# Altium schematic sheet HC-SR04_v3_SCH.SchDoc
size A3; SheetNumber: 1; SheetTotal: 1
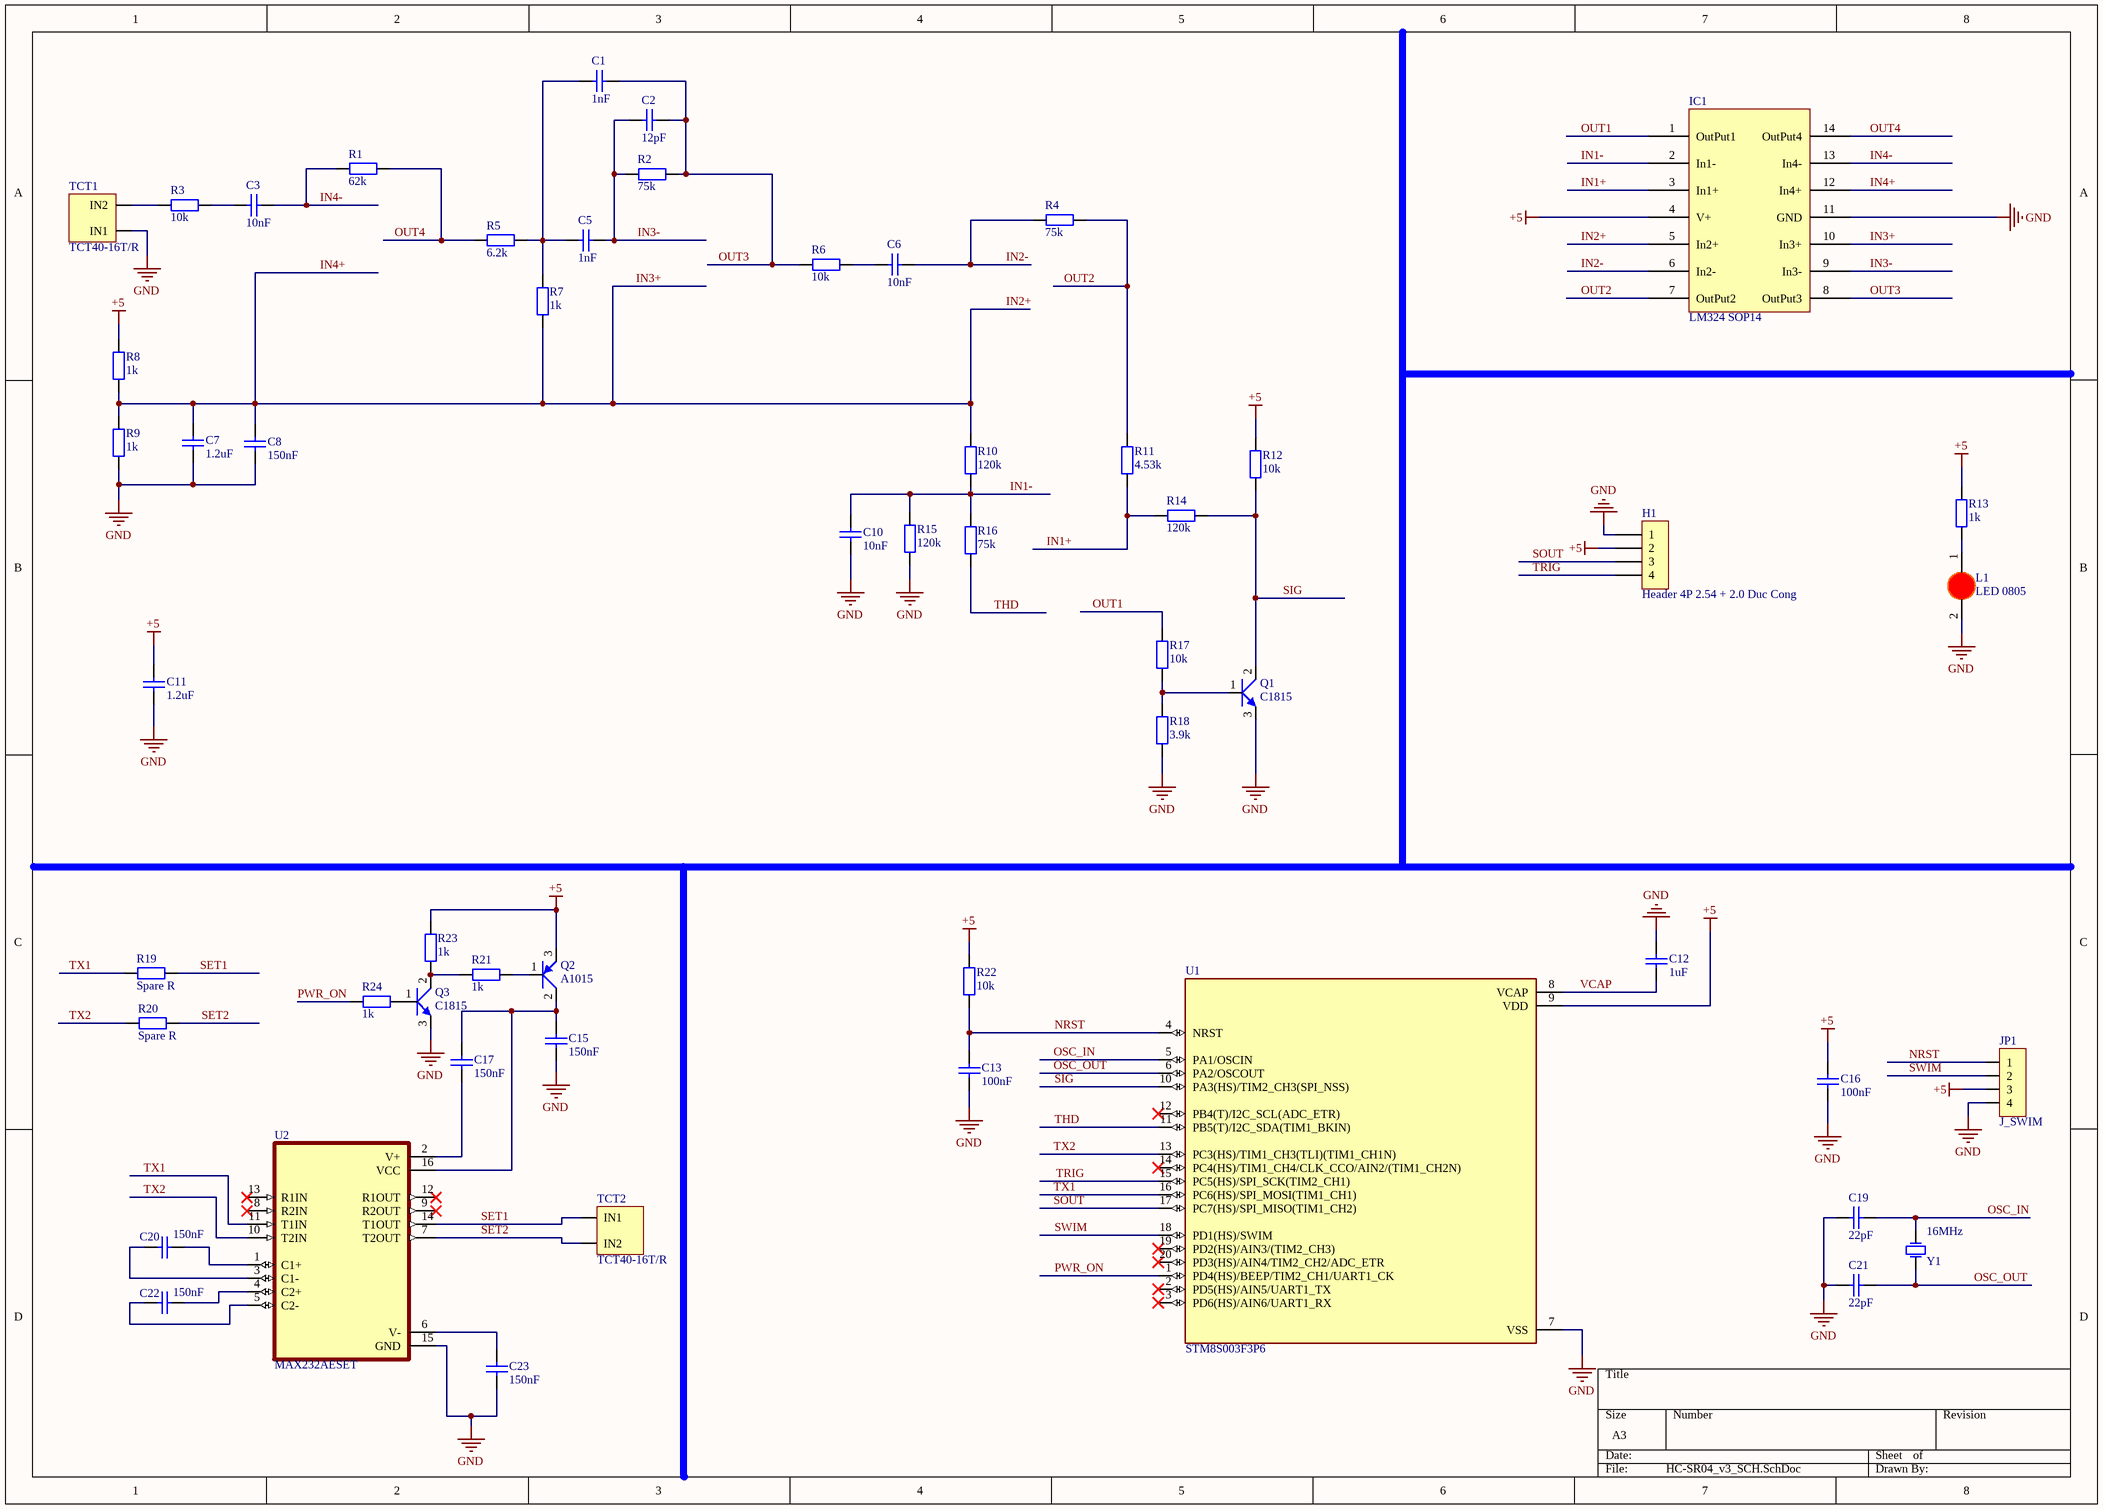
[diagram p0: HC-SR04_v3_SCH.SchDoc]

## Parts
C1  1nF  [CAP_SMD_0603]
C2  12pF  [CAP_SMD_0603]
C3  10nF  [CAP_SMD_0603]
C5  1nF  [CAP_SMD_0603]
C6  10nF  [CAP_SMD_0603]
C7  1.2uF  [CAP_SMD_0603]
C8  150nF  [CAP_SMD_0603]
C10  10nF  [CAP_SMD_0603]
C11  1.2uF  [CAP_SMD_0603]
C12  1uF  [CAP_SMD_0603]
C13  100nF  [CAP_SMD_0603]
C15  150nF  [CAP_SMD_0603]
C16  100nF  [CAP_SMD_0603]
C17  150nF  [CAP_SMD_0603]
C19  22pF  [CAP_SMD_0603]
C20  150nF  [CAP_SMD_0603]
C21  22pF  [CAP_SMD_0603]
C22  150nF  [CAP_SMD_0603]
C23  150nF  [CAP_SMD_0603]
H1  Header 4P 2.54 + 2.0 Duc Cong  [Header 4P DC 2.54 + 2.0]
IC1  LM324 SOP14  [SOIC14]
JP1  J_SWIM  [JP 1x4 DT]
L1  LED 0805  [LED-0805-Red]
Q1  C1815  [SOT23]
Q2  A1015  [SOT23]
Q3  C1815  [SOT23]
R1  62k  [RES_SMD_0603]
R2  75k  [RES_SMD_0603]
R3  10k  [RES_SMD_0603]
R4  75k  [RES_SMD_0603]
R5  6.2k  [RES_SMD_0603]
R6  10k  [RES_SMD_0603]
R7  1k  [RES_SMD_0603]
R8  1k  [RES_SMD_0603]
R9  1k  [RES_SMD_0603]
R10  120k  [RES_SMD_0603]
R11  4.53k  [RES_SMD_0603]
R12  10k  [RES_SMD_0603]
R13  1k  [RES_SMD_0603]
R14  120k  [RES_SMD_0603]
R15  120k  [RES_SMD_0603]
R16  75k  [RES_SMD_0603]
R17  10k  [RES_SMD_0603]
R18  3.9k  [RES_SMD_0603]
R19  Spare R  [RES_SMD_0603]
R20  Spare R  [RES_SMD_0603]
R21  1k  [RES_SMD_0603]
R22  10k  [RES_SMD_0603]
R23  1k  [RES_SMD_0603]
R24  1k  [RES_SMD_0603]
TCT1  TCT40-16T/R  [TCT40]
TCT2  TCT40-16T/R  [TCT40]
U1  STM8S003F3P6  [SOP65P640X120-20N]
U2  MAX232AESET  [SOIC16]
Y1  16MHz  [THACH ANH DAN 3215]

## Nets
+5: C11.1 C16.1 H1.2 IC1.4(V+) JP1.3 Q2.3(E) R8.2 R12.2 R13.2 R22.1 R23.1 U1.9(VDD)
GND: C7.2 C8.2 C10.2 C11.2 C12.1 C13.2 C15.2 C16.2 C19.1 C21.1 C23.2 H1.1 IC1.11(GND) JP1.4 L1.2(K) Q1.3(E) Q3.3(E) R9.1 R15.1 R18.1 TCT1.1(IN1) U1.7(VSS) U2.15(GND)
IN1+: IC1.3(In1+) R11.2 R14.1
IN1-: C10.1 IC1.2(In1-) R10.2 R15.2 R16.2
IN2+: C7.1 C8.1 IC1.5(In2+) IC1.10(In3+) IC1.12(In4+) R7.2 R8.1 R9.2 R10.1  [also labelled IN3+, IN4+]
IN2-: C6.1 IC1.6(In2-) R4.2
IN3-: C2.2 C5.1 IC1.9(In3-) R2.2
IN4-: C3.2 IC1.13(In4-) R1.2
NRST: C13.1 JP1.1 R22.2 U1.4(NRST)
OSC_IN: C19.2 U1.5(PA1/OSCIN) Y1.2(OSC2)
OSC_OUT: C21.2 U1.6(PA2/OSCOUT) Y1.1(OSC1)
OUT1: IC1.1(OutPut1) R17.2
OUT2: IC1.7(OutPut2) R4.1 R11.1
OUT3: C1.1 C2.1 IC1.8(OutPut3) R2.1 R6.2
OUT4: IC1.14(OutPut4) R1.1 R5.2
PWR_ON: R24.2 U1.1(PD4(HS)/BEEP/TIM2_CH1/UART1_CK)
SET1: R19.2 TCT2.1(IN1) U2.14(T1OUT)
SET2: R20.2 TCT2.2(IN2) U2.7(T2OUT)
SIG: Q1.2(C) R12.1 R14.2 U1.10(PA3(HS)/TIM2_CH3(SPI_NSS))
SOUT: H1.3 U1.17(PC7(HS)/SPI_MISO(TIM1_CH2))
SWIM: JP1.2 U1.18(PD1(HS)/SWIM)
THD: R16.1 U1.11(PB5(T)/I2C_SDA(TIM1_BKIN))
TRIG: H1.4 U1.15(PC5(HS)/SPI_SCK(TIM2_CH1))
TX1: R19.1 U1.16(PC6(HS)/SPI_MOSI(TIM1_CH1)) U2.11(T1IN)
TX2: R20.1 U1.13(PC3(HS)/TIM1_CH3(TLI)(TIM1_CH1N)) U2.10(T2IN)
VCAP: C12.2 U1.8(VCAP)
NetC1_2: C1.2 C5.2 R5.1 R7.1
NetC3_1: C3.1 R3.2
NetC6_2: C6.2 R6.1
NetC15_1: C15.1 C17.1 Q2.2(C) U2.16(VCC)
NetC17_2: C17.2 U2.2(V+)
NetC20_1: C20.1 U2.3(C1-)
NetC20_2: C20.2 U2.1(C1+)
NetC22_1: C22.1 U2.5(C2-)
NetC22_2: C22.2 U2.4(C2+)
NetC23_1: C23.1 U2.6(V-)
NetL1_1: L1.1(A) R13.1
NetQ1_1: Q1.1(B) R17.1 R18.2
NetQ2_1: Q2.1(B) R21.1
NetQ3_1: Q3.1(B) R24.1
NetQ3_2: Q3.2(C) R21.2 R23.2
NetR3_1: R3.1 TCT1.2(IN2)

Not connected (* = marked no-connect by the designer): U1 2(PD5(HS)/AIN5/UART1_TX)* 3(PD6(HS)/AIN6/UART1_RX)* 12(PB4(T)/I2C_SCL(ADC_ETR))* 14(PC4(HS)/TIM1_CH4/CLK_CCO/AIN2/(TIM1_CH2N))* 19(PD2(HS)/AIN3/(TIM2_CH3))* 20(PD3(HS)/AIN4/TIM2_CH2/ADC_ETR)*; U2 8(R2IN)* 9(R2OUT)* 12(R1OUT)* 13(R1IN)*

## Library data of the parts
C1 C2 C5 C6 C10-C13 C15-C17 C19-C23 = Tu 0603 102 50V 10%: Dán; Don_Vi: Con; So_Chan: 2; Ten_Linh_Kien: Tụ 0603 102-1nF 10% 50V; Ma_Hang: MH004566; Chung_Loai: Dán; Kieu_Chan: *
C3 = Tu 0603 103 50V 10%: Dán; Don_Vi: Con; So_Chan: 2; Ten_Linh_Kien: Tụ 0603 103-10nF 10% 50V; Ma_Hang: MH004567; Chung_Loai: Dán; Kieu_Chan: *
C7 C8 = Tu 0603 104 50V 10%: Dán; Don_Vi: Con; So_Chan: 2; Ten_Linh_Kien: Tụ 0603 104-100nF 10% 50V; Ma_Hang: MH004568; Chung_Loai: Dán; Kieu_Chan: *
H1 = Header 4P 2.54 + 2.0 Duc Cong: Cắm; Ten_Linh_Kien: Header 4P XH2.54-4P Đực Cong; Don_Vi: Con; Ma_Hang: MH001310; Chung_Loai: Cắm
IC1 = LM324 SOP14: Dán; Ma_Hang: MH002173; Don_Vi: Con; Ten_Linh_Kien: LM324 SOP14; Kieu_Chan: *; Ghi_Chu: *; Chung_Loai: Dán
JP1 = JP 1x4 2.54 Duc Thang: Cắm; Ten_Linh_Kien: Jump Đơn Đực 2.54MM 1x40P Thẳng 11MM; Don_Vi: Con; Ma_Hang: MH000903; Ghi_Chu: *; Kieu_Chan: *; Chung_Loai: Cắm
L1 = LED 0805 Do: Dán; Don_Vi: Con; Ma_Hang: MH000897; Ten_Linh_Kien: LED 0805 Màu Đỏ (Red); Ghi_Chu: *; Kieu_Chan: *; Chung_Loai: Dán
Q1 Q3 = Transistor_N_3P
Q2 = Transistor_P_3P
R1 R2 R4-R24 = Tro 0603 1% 1k: Dán; So_Chan: 2; Don_Vi: Con; Ten_Linh_Kien: Trở 0603 1% 1k; Ma_Hang: MH006334; Chung_Loai: Dán; Kieu_Chan: *
R3 = Tro 0603 1% 10k: Dán; Don_Vi: Con; So_Chan: 2; Ten_Linh_Kien: Trở 0603 1% 10k; Ma_Hang: MH006333; Chung_Loai: Dán; Kieu_Chan: *
TCT1 TCT2 = TCT40-16T/R: Piezoelectric Ceramic Ultrasonic Sensor
U1 = STM8S003F3P6: STM8 series Microcontroller IC 8-Bit 16MHz 8KB (8K x 8) FLASH 20-TSSOP; MF: STMicroelectronics; SnapEDA_Link: https://www.snapeda.com/parts/STM8S003F3P6/STMicroelectronics/view-part/?ref=snap; Package: TSSOP-20 STMicroelectronics; Value: *; MP: STM8S003F3P6; Check_prices: https://www.snapeda.com/parts/STM8S003F3P6/STMicroelectronics/view-part/?ref=eda
U2 = MAX232AESET: Dual Transmitter/Receiver RS-232 16-Pin SOIC N Tube; MF: Analog Devices; MP: MAX232AESE+; SnapEDA_Link: https://www.snapeda.com/parts/MAX232AESE+/Analog+Devices/view-part/?ref=snap; Package: SOIC-16 Maxim Integrated; Value: *; Check_prices: https://www.snapeda.com/parts/MAX232AESE+/Analog+Devices/view-part/?ref=eda
Y1 = Thach Anh SMD 3225: C700805; Chung_Loai: Dán; Ten_Linh_Kien: Thạch Anh 16Mhz SMD5032; Ma_Hang: MH001979; Don_Vi: Con; Ghi_Chu: *; Kieu_Chan: *